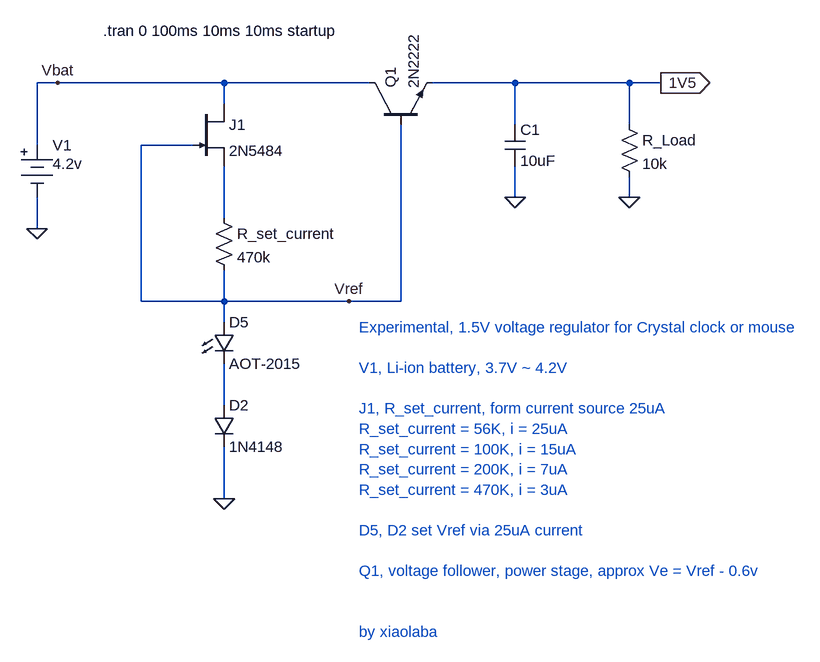
[diagram p0: schematic JFET_1.5V_Regulator.asc]
JFET_1.5V_Regulator.asc, the LTspice schematic file:
Version 4
SHEET 1 1284 1060
WIRE -64 112 -96 112
WIRE 192 112 -64 112
WIRE 416 112 192 112
WIRE 640 112 512 112
WIRE 816 112 640 112
WIRE 864 112 816 112
WIRE 192 144 192 112
WIRE 640 176 640 112
WIRE 816 176 816 112
WIRE -96 208 -96 112
WIRE 144 208 64 208
WIRE 640 288 640 240
WIRE 816 288 816 256
WIRE 192 320 192 240
WIRE -96 336 -96 288
WIRE 64 448 64 208
WIRE 192 448 192 400
WIRE 192 448 64 448
WIRE 384 448 192 448
WIRE 464 448 464 176
WIRE 464 448 384 448
WIRE 192 480 192 448
WIRE 192 608 192 544
WIRE 192 752 192 672
FLAG 192 752 0
FLAG -96 336 0
FLAG 640 288 0
FLAG 816 288 0
FLAG 864 112 1V5
IOPIN 864 112 Out
FLAG 384 448 Vref
FLAG -64 112 Vbat
SYMBOL njf 144 144 R0
SYMATTR InstName J1
SYMATTR Value 2N5484
SYMBOL npn 416 176 R270
SYMATTR InstName Q1
SYMATTR Value 2N2222
SYMBOL res 176 304 R0
SYMATTR InstName R_set_current
SYMATTR Value 470k
SYMBOL diode 176 608 R0
SYMATTR InstName D2
SYMATTR Value 1N4148
SYMBOL Misc\\battery -96 192 R0
WINDOW 3 24 44 Left 2
WINDOW 123 0 0 Left 0
WINDOW 39 0 0 Left 0
SYMATTR InstName V1
SYMATTR Value 4.2v
SYMBOL cap 624 176 R0
SYMATTR InstName C1
SYMATTR Value 10uF
SYMBOL res 800 160 R0
SYMATTR InstName R_Load
SYMATTR Value 10k
SYMBOL LED 176 480 R0
SYMATTR InstName D5
SYMATTR Value AOT-2015
TEXT 6 32 Left 2 !.tran 0 100ms 10ms 10ms startup
TEXT 400 488 Left 2 ;Experimental, 1.5V voltage regulator for Crystal clock or mouse\n \nV1, Li-ion battery, 3.7V ~ 4.2V\n \nJ1, R_set_current, form current source 25uA\nR_set_current = 56K, i = 25uA\nR_set_current = 100K, i = 15uA\nR_set_current = 200K, i = 7uA\nR_set_current = 470K, i = 3uA\n \nD5, D2 set Vref via 25uA current\n \nQ1, voltage follower, power stage, approx Ve = Vref - 0.6v\n \n \nby xiaolaba

The netlist it stands for:
* JFET_1.5V_Regulator.asc
J1 Vbat Vref N001 2N5484
Q1 Vbat Vref 1V5 0 2N2222
R_set_current N001 Vref 470k
D2 N002 0 1N4148
V1 Vbat 0 4.2v
C1 1V5 0 10uF
R_Load 1V5 0 10k
D5 Vref N002 AOT-2015
.model D D
.lib standard.dio
.model NPN NPN
.model PNP PNP
.lib standard.bjt
.model NJF NJF
.model PJF PJF
.lib standard.jft
.tran 0 100ms 10ms 10ms startup
* Experimental, 1.5V voltage regulator for Crystal clock or mouse
* V1, Li-ion battery, 3.7V ~ 4.2V
* J1, R_set_current, form current source 25uA
* R_set_current = 56K, i = 25uA
* R_set_current = 100K, i = 15uA
* R_set_current = 200K, i = 7uA
* R_set_current = 470K, i = 3uA
* D5, D2 set Vref via 25uA current
* Q1, voltage follower, power stage, approx Ve = Vref - 0.6v
* by xiaolaba
.backanno
.end